# EAGLE schematic TelemetryModule (EAGLE 9.5.2)
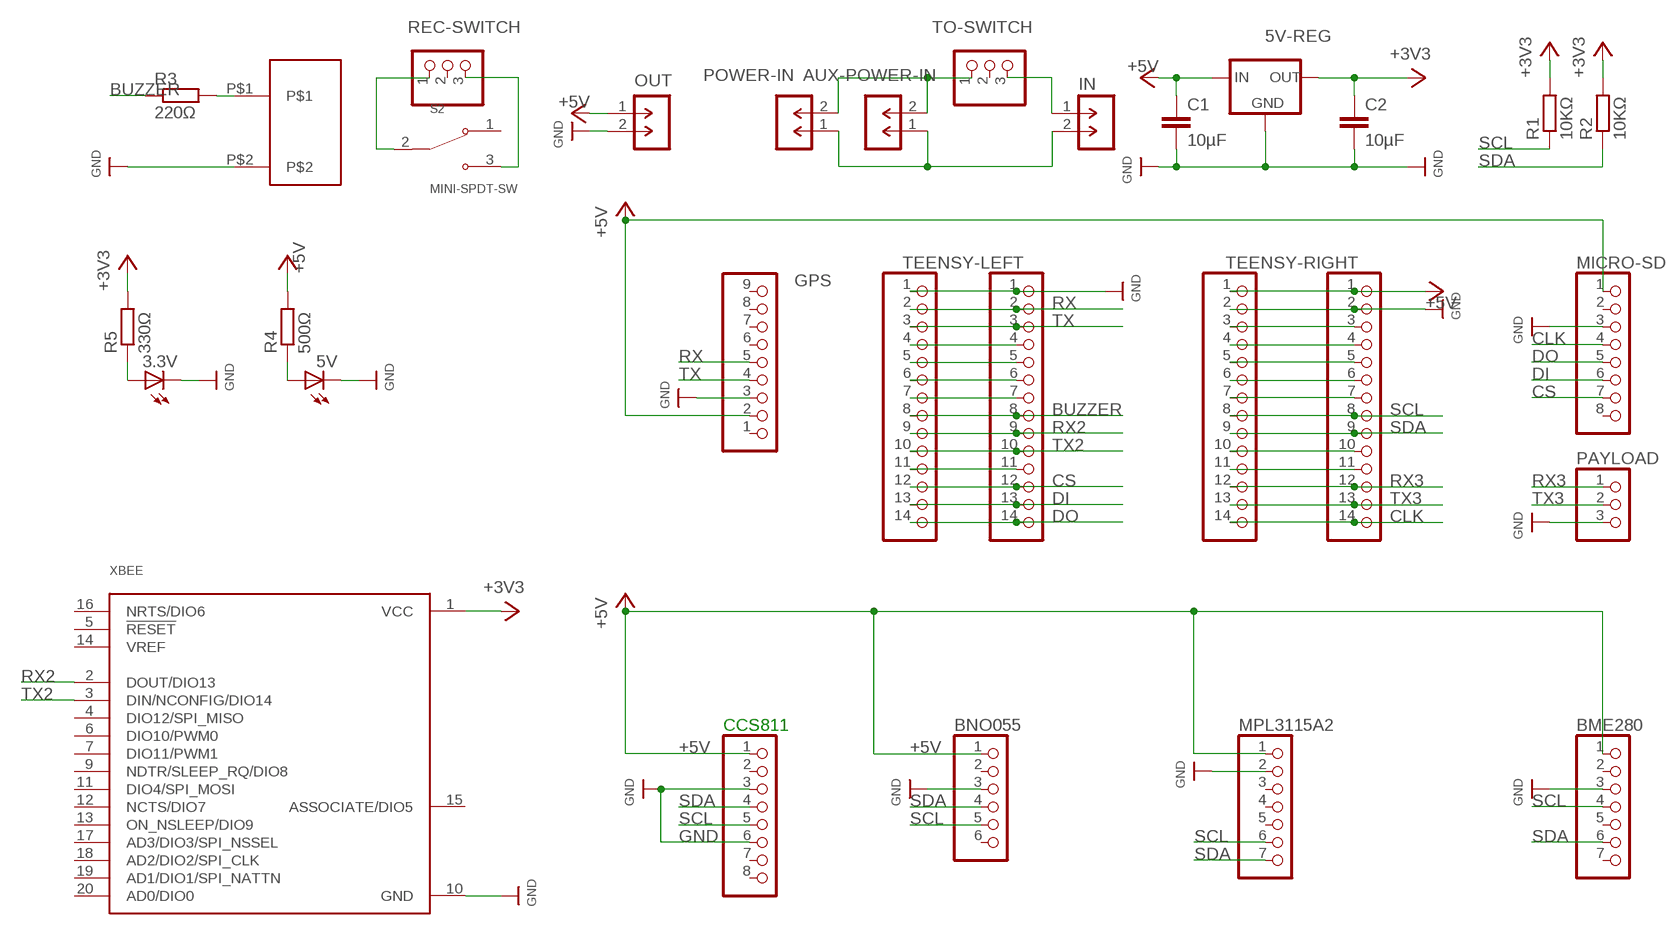
[diagram p0: schematic, sheet 1]

## Parts
3.3V  LED5MM  [LED5MM]
5V  LED5MM  [LED5MM]
5V-REG  LD1117V33  [LD1117V33]
AUX-POWER-IN  M-1X02-SIP-100-40Y  [SIP-100-02-40Y]
BME280  HEADER-1X770MIL  [1X07_ROUND_70]
BNO055  HEADER-1X676MIL  [1X06_ROUND_76]
C1  10µF  C2,5-3  [C2.5-3]
C2  10µF  C2,5-3  [C2.5-3]
CCS811  HEADER-1X870MIL  [1X08_ROUND_70]
GPS  HEADER-1X970MIL  [1X09_ROUND_70]
IN  M-1X02-SIP-100-40Y  [SIP-100-02-40Y]
MICRO-SD  PINHD-1X8BIG  [1X08-BIG]
MPL3115A2  HEADER-1X770MIL  [1X07_ROUND_70]
OUT  M-1X02-SIP-100-40Y  [SIP-100-02-40Y]
PAYLOAD  PINHD-1X3CB  [1X03-CLEANBIG]
POWER-IN  M-1X02-SIP-100-40Y  [SIP-100-02-40Y]
R1  10KΩ  R-EU_0207/10  [0207/10]
R2  10KΩ  R-EU_0207/10  [0207/10]
R3  220Ω  R-EU_0207/10  [0207/10]
R4  500Ω  R-EU_0207/10  [0207/10]
R5  330Ω  R-EU_0207/10  [0207/10]
REC-SWITCH  PINHD-1X3CB  [1X03-CLEANBIG]
S2  MINI-SPDT-SW  [SW_MINI-SPDT-SW]
TEENSY-LEFT  PINHD-1X14-CB  [1X14-CB]
TEENSY-LEFT-DUPE  PINHD-1X14-CB  [1X14-CB]
TEENSY-RIGHT  PINHD-1X14-CB  [1X14-CB]
TEENSY-RIGHT-DUPE  PINHD-1X14-CB  [1X14-CB]
TO-SWITCH  PINHD-1X3CB  [1X03-CLEANBIG]
U$3  PS1240P02BT  [PS1240P02BT]
XBEE  XBP9B-XCST-002  [DIP2200W51P200L3294H279Q20P]

## Nets
+3V3: 5V-REG.OUT C2.1 R1.2 R2.2 R5.2 XBEE.1(VCC)
+5V: 5V-REG.IN BME280.1 BNO055.1 C1.1 CCS811.1 GPS.2 MICRO-SD.1 MPL3115A2.1 OUT.1 R4.2 TEENSY-RIGHT-DUPE.1 TEENSY-RIGHT.1
BUZZER: R3.1 TEENSY-LEFT-DUPE.8 TEENSY-LEFT.8
CLK: MICRO-SD.4 TEENSY-RIGHT-DUPE.14 TEENSY-RIGHT.14
CS: MICRO-SD.7 TEENSY-LEFT-DUPE.12 TEENSY-LEFT.12
DI: MICRO-SD.6 TEENSY-LEFT-DUPE.13 TEENSY-LEFT.13
DO: MICRO-SD.5 TEENSY-LEFT-DUPE.14 TEENSY-LEFT.14
GND: 3.3V.K(C) 5V-REG.GND 5V.K(C) BME280.3 BNO055.3 C1.2 C2.2 CCS811.3 CCS811.6 GPS.3 MICRO-SD.3 MPL3115A2.2 OUT.2 PAYLOAD.3 TEENSY-LEFT-DUPE.1 TEENSY-LEFT.1 TEENSY-RIGHT-DUPE.2 TEENSY-RIGHT.2 U$3.P$2 XBEE.10(GND)
N$1: AUX-POWER-IN.1 IN.2 POWER-IN.1
N$2: AUX-POWER-IN.2 POWER-IN.2 TO-SWITCH.1
N$3: REC-SWITCH.1 S2.2
N$4: REC-SWITCH.3 S2.3
N$5: IN.1 TO-SWITCH.3
N$6: R3.2 U$3.P$1
N$7: TEENSY-LEFT-DUPE.4 TEENSY-LEFT.4
N$8: TEENSY-LEFT-DUPE.5 TEENSY-LEFT.5
N$9: TEENSY-LEFT-DUPE.6 TEENSY-LEFT.6
N$10: TEENSY-LEFT-DUPE.7 TEENSY-LEFT.7
N$11: TEENSY-LEFT-DUPE.11 TEENSY-LEFT.11
N$12: TEENSY-RIGHT-DUPE.7 TEENSY-RIGHT.7
N$13: TEENSY-RIGHT-DUPE.6 TEENSY-RIGHT.6
N$14: TEENSY-RIGHT-DUPE.5 TEENSY-RIGHT.5
N$15: TEENSY-RIGHT-DUPE.4 TEENSY-RIGHT.4
N$16: TEENSY-RIGHT-DUPE.3 TEENSY-RIGHT.3
N$17: 5V.A R4.1
N$18: TEENSY-RIGHT-DUPE.10 TEENSY-RIGHT.10
N$19: TEENSY-RIGHT-DUPE.11 TEENSY-RIGHT.11
N$20: 3.3V.A R5.1
RX: GPS.5 TEENSY-LEFT-DUPE.2 TEENSY-LEFT.2
RX2: TEENSY-LEFT-DUPE.9 TEENSY-LEFT.9 XBEE.2(DOUT/DIO13)
RX3: PAYLOAD.1 TEENSY-RIGHT-DUPE.12 TEENSY-RIGHT.12
SCL: BME280.4 BNO055.5 CCS811.5 MPL3115A2.6 R1.1 TEENSY-RIGHT-DUPE.8 TEENSY-RIGHT.8
SDA: BME280.6 BNO055.4 CCS811.4 MPL3115A2.7 R2.1 TEENSY-RIGHT-DUPE.9 TEENSY-RIGHT.9
TX: GPS.4 TEENSY-LEFT-DUPE.3 TEENSY-LEFT.3
TX2: TEENSY-LEFT-DUPE.10 TEENSY-LEFT.10 XBEE.3(DIN/NCONFIG/DIO14)
TX3: PAYLOAD.2 TEENSY-RIGHT-DUPE.13 TEENSY-RIGHT.13
Unconnected: BME280.2 BME280.5 BME280.7 BNO055.2 BNO055.6 CCS811.2 CCS811.7 CCS811.8 GPS.1 GPS.6 GPS.7 GPS.8 GPS.9 MICRO-SD.2 MICRO-SD.8 MPL3115A2.3 MPL3115A2.4 MPL3115A2.5 REC-SWITCH.2 S2.1 TO-SWITCH.2 XBEE.4(DIO12/SPI_MISO) XBEE.5(!RESET) XBEE.6(DIO10/PWM0) XBEE.7(DIO11/PWM1) XBEE.9(NDTR/SLEEP_RQ/DIO8) XBEE.11(DIO4/SPI_MOSI) XBEE.12(NCTS/DIO7) XBEE.13(ON_NSLEEP/DIO9) XBEE.14(VREF) XBEE.15(ASSOCIATE/DIO5) XBEE.16(NRTS/DIO6) XBEE.17(AD3/DIO3/SPI_NSSEL) XBEE.18(AD2/DIO2/SPI_CLK) XBEE.19(AD1/DIO1/SPI_NATTN) XBEE.20(AD0/DIO0)

## Library data of the parts
3.3V 5V = adafruit:LED: LED OSRAM: - CHIPLED LG R971, LG N971, LY N971, LG Q971, LY Q971, LO R971, LY R971 LH N974, LH R974 LS Q976, LO Q976, LY Q976 LO Q996 - Hyper CHIPLED LW Q18S LB Q993, LB Q99A, LB R99A - SideLED LS A670, LO A670, LY A670, LG A670, LP A670 LB A673, LV A673, LT A673, LW A673 LH A674 LY A675 LS A676, LA A676, LO A676, LY A676, LW A676 LS A679, LY A679, LG A679 - Hyper Micro SIDELED® LS Y876, LA Y876, LO Y876, LY Y876 LT Y87S - SmartLED LW L88C, LW L88S LB L89C, LB L89S, LG L890 LS L89K, LO L89K, LY L89K LS L896, LA L896, LO L896, LY L896 - TOPLED LS T670, LO T670, LY T670, LG T670, LP T670 LSG T670, LSP T670, LSY T670, LOP T670, LYG T670 LG T671, LOG T671, LSG T671 LB T673, LV T673, LT T673, LW T673 LH T674 LS T676, LA T676, LO T676, LY T676, LB T676, LH T676, LSB T676, LW T676 LB T67C, LV T67C, LT T67C, LS T67K, LO T67K, LY T67K, LW E67C LS E67B, LA E67B, LO E67B, LY E67B, LB E67C, LV E67C, LT E67C LW T67C LS T679, LY T679, LG T679 LS T770, LO T770, LY T770, LG T770, LP T770 LB T773, LV T773, LT T773, LW T773 LH T774 LS E675, LA E675, LY E675, LS T675 LS T776, LA T776, LO T776, LY T776, LB T776 LHGB T686 LT T68C, LB T68C - Hyper Mini TOPLED® LB M676 - Mini TOPLED Santana® LG M470 LS M47K, LO M47K, LY M47K Source: http://www.osram.convergy.de/
5V-REG = LD1117V33:LD1117V33
AUX-POWER-IN IN OUT POWER-IN = con-headers-jp:M-1X02-: MALE HEADER
BME280 MPL3115A2 = microbuilder:HEADER-1X7: PIN HEADER
BNO055 = microbuilder:HEADER-1X6: PIN HEADER
C1 C2 = capacitor-wima:C: CAPACITOR naming: grid - package width
CCS811 = microbuilder:HEADER-1X8: PIN HEADER
GPS = microbuilder:HEADER-1X9: PIN HEADER
MICRO-SD = adafruit:PINHD-1X8: PIN HEADER
PAYLOAD REC-SWITCH TO-SWITCH = adafruit:PINHD-1X3: PIN HEADER
R1-R5 = rcl:R-EU_: RESISTOR, European symbol; SPICEPREFIX: R
S2 = MINI-SPDT-SW:MINI-SPDT-SW: Simple breadboard friendly SPDT slide switch. Rated at 30V/200mA with operating force of 250 +/-100gf.; AVAILABILITY: Unavailable; DESCRIPTION: Slide Switches MINI SPDT SWITCH; MF: Gravitech; MP: MINI-SPDT-SW; PACKAGE: None; PRICE: None
TEENSY-LEFT TEENSY-LEFT-DUPE TEENSY-RIGHT TEENSY-RIGHT-DUPE = adafruit:PINHD-1X14: PIN HEADER
U$3 = PS1240P02BT:PS1240P02BT; AVAILABILITY: Unavailable; DESCRIPTION: Buzzers Transducer, Externally Driven Piezo 3V 4kHz 60dB @ 3V, 10cm Through Hole PC Pins; MF: TDK; MP: PS1240P02BT; PACKAGE: 2020 TDK; PRICE: None
XBEE = XBP9B-XCST-002:XBP9B-XCST-002: XBee-PRO 900HP DigiMesh 900 MHz 200 Kbps RF Module with U.FL Connector; DESCRIPTION: 802.15.4 LR-WPAN 900MHz 19.2Kbps; DIGI-KEY_PART_NUMBER: 602-1294-ND; DIGI-KEY_PURCHASE_URL: https://www.digikey.com/product-detail/en/digi-international/XBP9B-XCST-002/602-1294-ND/3482818?utm_source=snapeda&utm_medium=aggregator&utm_campaign=symbol; MF: Digi International; MP: XBP9B-XCST-002; PACKAGE: Module Digi International